# Altium project PCB_Project.PrjPcb
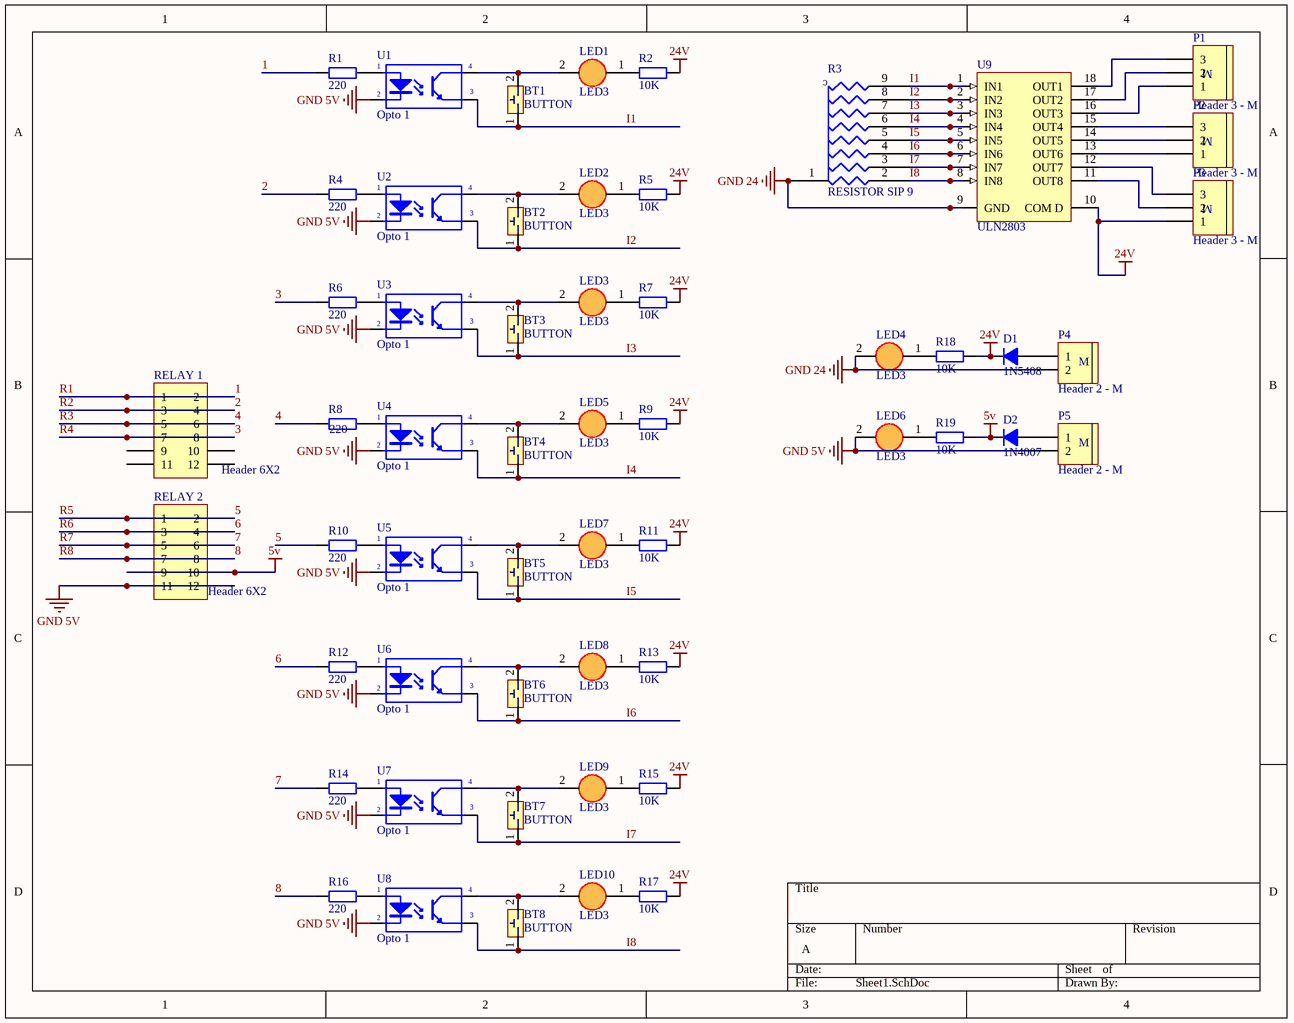
[diagram p0: Sheet1.SchDoc]
1 sheet, 55 parts. Net scope: global (net labels, ports and power ports of the same name join across sheets).
Board file: PCB1.PcbDoc

## Sheet Sheet1.SchDoc
size A

### Parts
BT1  BUTTON  [button 4 pin]
BT2  BUTTON  [button 4 pin]
BT3  BUTTON  [button 4 pin]
BT4  BUTTON  [button 4 pin]
BT5  BUTTON  [button 4 pin]
BT6  BUTTON  [button 4 pin]
BT7  BUTTON  [button 4 pin]
BT8  BUTTON  [button 4 pin]
D1  1N5408  [D5A]
D2  1N4007  [D1A]
LED1  LED3  [LED3mm]
LED2  LED3  [LED3mm]
LED3  LED3  [LED3mm]
LED4  LED3  [LED3mm]
LED5  LED3  [LED3mm]
LED6  LED3  [LED3mm]
LED7  LED3  [LED3mm]
LED8  LED3  [LED3mm]
LED9  LED3  [LED3mm]
LED10  LED3  [LED3mm]
P1  Header 3 - M  [Medium - Header 3]
P2  Header 3 - M  [Medium - Header 3]
P3  Header 3 - M  [Medium - Header 3]
P4  Header 2 - M  [Medium - Header 2]
P5  Header 2 - M  [Medium - Header 2]
R1  220  [R1/4W]
R2  10K  [R1/4W]
R3  RESISTOR SIP 9  [HDR1X9]
R4  220  [R1/4W]
R5  10K  [R1/4W]
R6  220  [R1/4W]
R7  10K  [R1/4W]
R8  220  [R1/4W]
R9  10K  [R1/4W]
R10  220  [R1/4W]
R11  10K  [R1/4W]
R12  220  [R1/4W]
R13  10K  [R1/4W]
R14  220  [R1/4W]
R15  10K  [R1/4W]
R16  220  [R1/4W]
R17  10K  [R1/4W]
R18  10K  [R1/4W]
R19  10K  [R1/4W]
RELAY_1  Header 6X2  [HDR2X6]
RELAY_2  Header 6X2  [HDR2X6]
U1  Opto 1  [DIP4]
U2  Opto 1  [DIP4]
U3  Opto 1  [DIP4]
U4  Opto 1  [DIP4]
U5  Opto 1  [DIP4]
U6  Opto 1  [DIP4]
U7  Opto 1  [DIP4]
U8  Opto 1  [DIP4]
U9  value ULN2803  [DIP 18]  (hidden comment: IC)

### Nets
5v: D2.2(K) R19.2 RELAY_2.9 RELAY_2.10
24V: D1.2(K) P3.1 R2.2 R5.2 R7.2 R9.2 R11.2 R13.2 R15.2 R17.2 R18.2 U9.10(COM_D)
GND 5V: LED6.2(K) P5.2 RELAY_2.11 RELAY_2.12 U1.2(K) U2.2(K) U3.2(K) U4.2(K) U5.2(K) U6.2(K) U7.2(K) U8.2(K)
GND 24: LED4.2(K) P4.2 R3.1 U9.9(GND)
1: R1.1 RELAY_1.1 RELAY_1.2  [also labelled R1]
2: R4.1 RELAY_1.3 RELAY_1.4  [also labelled R2]
3: R6.1 RELAY_1.7 RELAY_1.8  [also labelled R4]
4: R8.1 RELAY_1.5 RELAY_1.6  [also labelled R3]
5: R10.1 RELAY_2.1 RELAY_2.2  [also labelled R5]
6: R12.1 RELAY_2.3 RELAY_2.4  [also labelled R6]
7: R14.1 RELAY_2.5 RELAY_2.6  [also labelled R7]
8: R16.1 RELAY_2.7 RELAY_2.8  [also labelled R8]
I1: BT1.1 R3.9 U1.3(E) U9.1(IN1)
I2: BT2.1 R3.8 U2.3(E) U9.2(IN2)
I3: BT3.1 R3.7 U3.3(E) U9.3(IN3)
I4: BT4.1 R3.6 U4.3(E) U9.4(IN4)
I5: BT5.1 R3.5 U5.3(E) U9.5(IN5)
I6: BT6.1 R3.4 U6.3(E) U9.6(IN6)
I7: BT7.1 R3.3 U7.3(E) U9.7(IN7)
I8: BT8.1 R3.2 U8.3(E) U9.8(IN8)
NetBT1_2: BT1.2 LED1.2(K) U1.4(C)
NetBT2_2: BT2.2 LED2.2(K) U2.4(C)
NetBT3_2: BT3.2 LED3.2(K) U3.4(C)
NetBT4_2: BT4.2 LED5.2(K) U4.4(C)
NetBT5_2: BT5.2 LED7.2(K) U5.4(C)
NetBT6_2: BT6.2 LED8.2(K) U6.4(C)
NetBT7_2: BT7.2 LED9.2(K) U7.4(C)
NetBT8_2: BT8.2 LED10.2(K) U8.4(C)
NetD1_1: D1.1(A) P4.1
NetD2_1: D2.1(A) P5.1
NetLED1_1: LED1.1(A) R2.1
NetLED2_1: LED2.1(A) R5.1
NetLED3_1: LED3.1(A) R7.1
NetLED4_1: LED4.1(A) R18.1
NetLED5_1: LED5.1(A) R9.1
NetLED6_1: LED6.1(A) R19.1
NetLED7_1: LED7.1(A) R11.1
NetLED8_1: LED8.1(A) R13.1
NetLED9_1: LED9.1(A) R15.1
NetLED10_1: LED10.1(A) R17.1
NetP1_1: P1.1 U9.16(OUT3)
NetP1_2: P1.2 U9.17(OUT2)
NetP1_3: P1.3 U9.18(OUT1)
NetP2_1: P2.1 U9.13(OUT6)
NetP2_2: P2.2 U9.14(OUT5)
NetP2_3: P2.3 U9.15(OUT4)
NetP3_2: P3.2 U9.11(OUT8)
NetP3_3: P3.3 U9.12(OUT7)
NetR1_2: R1.2 U1.1(A)
NetR4_2: R4.2 U2.1(A)
NetR6_2: R6.2 U3.1(A)
NetR8_2: R8.2 U4.1(A)
NetR10_2: R10.2 U5.1(A)
NetR12_2: R12.2 U6.1(A)
NetR14_2: R14.2 U7.1(A)
NetR16_2: R16.2 U8.1(A)

Not connected (* = marked no-connect by the designer): RELAY_1 9 10 11 12

### Notes on the sheet
- (in symbol Header 2 - M) M
- (in symbol Header 3 - M) M
- (in symbol RESISTOR SIP 9) C

### Library data of the parts
BT1-BT8 = BUTTON 4 PIN
D1 = D5A: Diode 5A; Value: 1N5408
D2 = D1A: Diode 1A; Value: 1N4007
LED1-LED10 = LED 3mm
P1-P3 = Header 3 - M: Header, 3-Pin, Medium; LatestRevisionDate: 17-Jul-2002; LatestRevisionNote: Re-released for DXP Platform.; Publisher: Altium Limited
P4 P5 = Header 2 - M: Header, 2-Pin, Medium; LatestRevisionDate: 17-Jul-2002; LatestRevisionNote: Re-released for DXP Platform.; Publisher: Altium Limited
R1 R2 R4-R19 = R1/4W: Resistor 1/4W; Value: R1/4W - 1K
R3 = RESISTOR SIP 9: Text Field1: 30; Text Field2: 90
RELAY_1 RELAY_2 = Header 6X2: Header, 6-Pin, Dual row; LatestRevisionDate: 17-Jul-2002; LatestRevisionNote: Re-released for DXP Platform.; Publisher: Altium Limited
U1-U8 = Opto 1: Single; Value: TLP5211
U9 = ULN2803